# Altium schematic sheet RF.schdoc
size A4
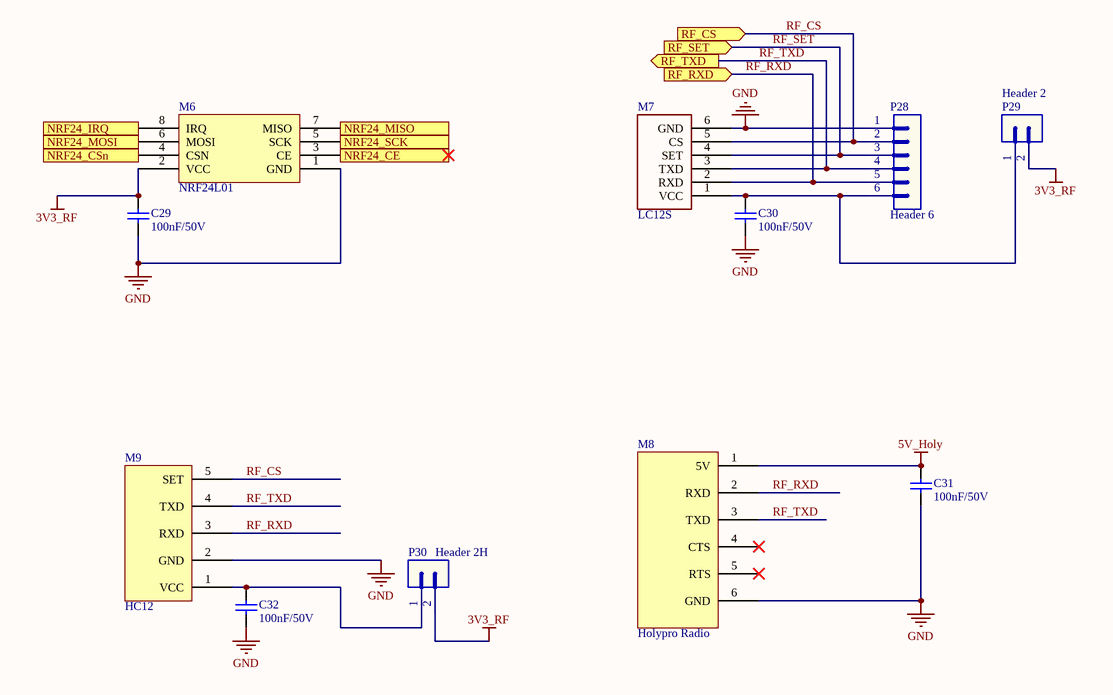
[diagram p0: RF.schdoc]

## Parts
C29  value 100nF/50V  [CAP-SM-0805]  (hidden comment: Cap-100nF-50V-0805)
C30  value 100nF/50V  [CAP-SM-0805]  (hidden comment: Cap-100nF-50V-0805)
C31  value 100nF/50V  [CAP-SM-0805]  (hidden comment: Cap-100nF-50V-0805)
C32  value 100nF/50V  [CAP-SM-0805]  (hidden comment: Cap-100nF-50V-0805)
M6  NRF24L01  [NRF24L01]
M7  LC12S  [LC12S]
M8  Holypro Radio  [PCBComponent_1]
M9  HC12  [PCBComponent_1]
P28  Header 6  [JP6]
P29  Header 2  [JP2]
P30  Header 2H  [JP2H]

## Ports
NRF24_CE (in), NRF24_CSn (in), NRF24_IRQ (out), NRF24_MISO (out), NRF24_MOSI (in), NRF24_SCK (in), RF_CS (in), RF_RXD (in), RF_SET (in), RF_TXD (out)

## Nets
3V3_RF: C29.2 M6.2(VCC) P29.2 P30.2
5V_Holy: C31.2 M8.1(5V)
GND: C29.1 C30.1 C31.1 C32.1 M6.1(GND) M7.6(GND) M8.6(GND) M9.2(GND) P28.1
NRF24_CE: M6.3(CE) ; port NRF24_CE
NRF24_CSn: M6.4(CSN) ; port NRF24_CSn
NRF24_IRQ: M6.8(IRQ) ; port NRF24_IRQ
NRF24_MISO: M6.7(MISO) ; port NRF24_MISO
NRF24_MOSI: M6.6(MOSI) ; port NRF24_MOSI
NRF24_SCK: M6.5(SCK) ; port NRF24_SCK
RF_CS: M7.5(CS) M9.5(SET) P28.2 ; port RF_CS
RF_RXD: M7.2(RXD) M8.2(RXD) M9.3(RXD) P28.5 ; port RF_RXD
RF_SET: M7.4(SET) P28.3 ; port RF_SET
RF_TXD: M7.3(TXD) M8.3(TXD) M9.4(TXD) P28.4 ; port RF_TXD
NetC30_2: C30.2 M7.1(VCC) P28.6 P29.1
NetC32_2: C32.2 M9.1(VCC) P30.1

Not connected (* = marked no-connect by the designer): M8 4(CTS)* 5(RTS)*

## Notes on the sheet
- Title
- Size:
- Date:
- A4
- Number:
- Time:
- Revision:
- Sheet
- of
- File:

## Library data of the parts
C29-C32 = Cap-100nF-50V-0805: CAP CER 0.1UF 50V Y5V 0805; Manufacturer: Samsung Electro-Mechanics; Manufacturer Part Number: CL21F104ZBCNNNC; Local Supplier: thegioiic; Local Supplier Link: https://thegioiic.com/products/tu-100nf-0-1uf-50v-0805; Supplier 1: Digikey; Supplier 1 Part Number: 1276-1007-1-ND; Supplier 1 Link: https://www.digikey.com/product-detail/en/samsung-electro-mechanics/CL21F104ZBCNNNC/1276-1007-1-ND/3889093
P28 = Header 6: Header, 6-Pin; LatestRevisionDate: 17-Jul-2002; LatestRevisionNote: Re-released for DXP Platform.; Publisher: Altium Limited
P29 = Header 2: Header, 2-Pin; LatestRevisionDate: 17-Jul-2002; LatestRevisionNote: Re-released for DXP Platform.; Publisher: Altium Limited
P30 = Header 2H: Header, 2-Pin, Right Angle; LatestRevisionDate: 17-Jul-2002; LatestRevisionNote: Re-released for DXP Platform.; Publisher: Altium Limited
M6 = NRF24L01: LINK: https://lastminuteengineers.com/nrf24l01-arduino-wireless-communication/
M8 = Holypro Radio: Supplier link: https://www.lazada.vn/products/ld-holybro-433mhz-915-mhz-500-mw-thu-phat-vo-tuyen-xa-bo-v3-cho-pixhawk-4-dieu-khien-chuyen-bay-i430804435-s768474304.html?spm=a2o4n.searchlist.list.4.25396b19yIS9XO&search=1
M9 = HC12: Local supplier Part number: HS000897; Local supplier: Hshop; Local supplier link: https://hshop.vn/products/mach-thu-phat-rf-uart-si4463-433mhzkhoang-coch-1km